# Altium schematic sheet Cart.SchDoc: Cart
size Tabloid; ApprovedBy: NA; CompanyName: Cospan Design LLC; DrawnBy: David McCoy; Engineer: David McCoy; DocumentNumber: 12; Revision: A; SheetNumber: 12; SheetTotal: 18; Client: OSH; Project: Guppy Buddy; ProjectPrettyName: Guppy Buddy
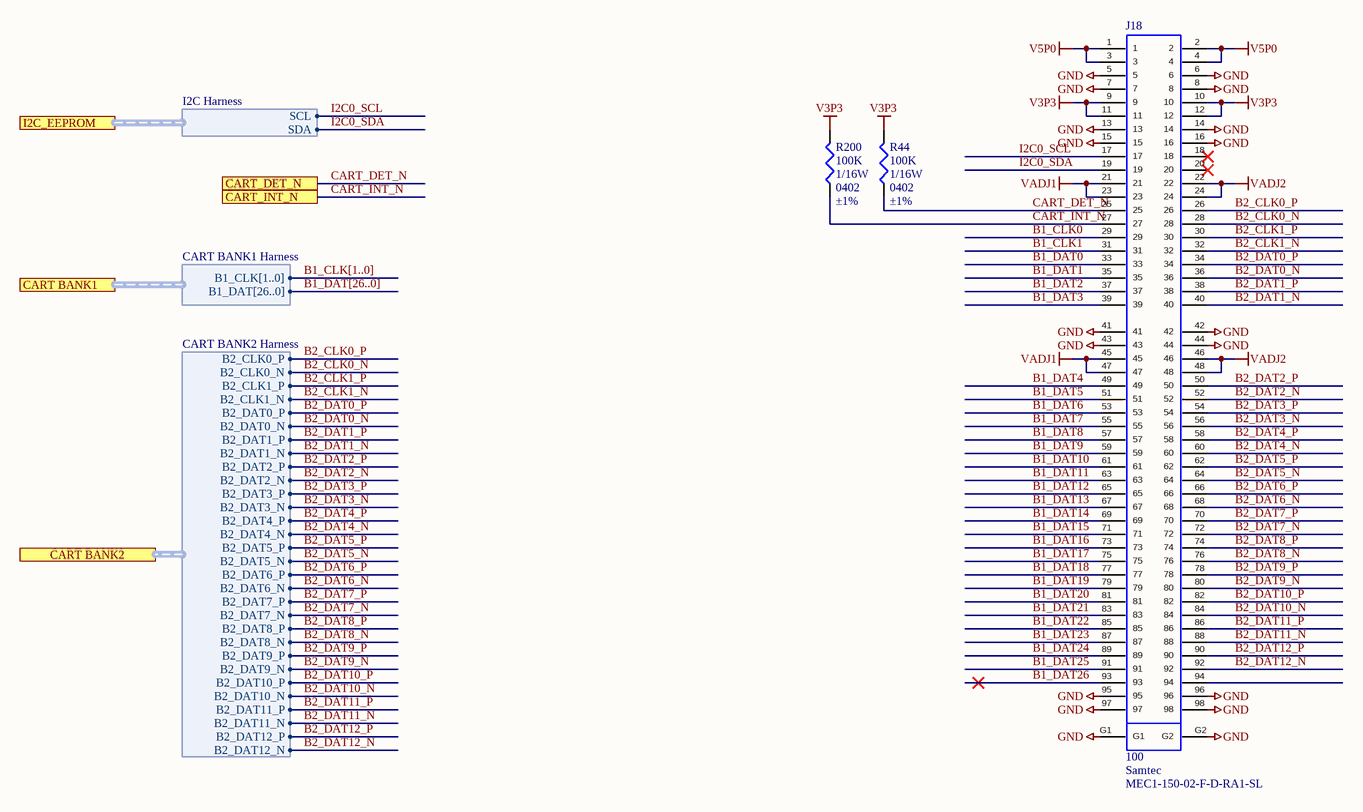
[diagram p0: Cart.SchDoc]

## Parts
J18  Number of Contacts: 100  Manufacturer 1: Samtec  Manufacturer Part Number 1: MEC1-150-02-F-D-RA1-SL  [MEC1-150-XX-XX-D-RAX-SL]  (hidden comment: J_MEC1-150-02-F-D-RA1-SL)
R44  Resistance In Ohms: 100K  Power (Watts): 1/16W  Case: 0402  Tolerance: ±1%  [R_0402]  (hidden comment: R_0402_100K)
R200  Resistance In Ohms: 100K  Power (Watts): 1/16W  Case: 0402  Tolerance: ±1%  [R_0402]  (hidden comment: R_0402_100K)

## Ports
CART BANK1 (harness CART BANK1 Harness), CART BANK2 (harness CART BANK2 Harness), CART_DET_N, CART_INT_N, I2C_EEPROM (harness I2C Harness)

## Harnesses
I2C Harness: SCL, SDA
CART BANK2 Harness: B2_CLK0_P, B2_CLK0_N, B2_CLK1_P, B2_CLK1_N, B2_DAT0_P, B2_DAT0_N, B2_DAT1_P, B2_DAT1_N, B2_DAT2_P, B2_DAT2_N, B2_DAT3_P, B2_DAT3_N, B2_DAT4_P, B2_DAT4_N, B2_DAT5_P, B2_DAT5_N, B2_DAT6_P, B2_DAT6_N, B2_DAT7_P, B2_DAT7_N, B2_DAT8_P, B2_DAT8_N, B2_DAT9_P, B2_DAT9_N, B2_DAT10_P, B2_DAT10_N, B2_DAT11_P, B2_DAT11_N, B2_DAT12_P, B2_DAT12_N
CART BANK1 Harness: B1_CLK[1..0], B1_DAT[26..0]

## Nets
GND: J18.5 J18.6 J18.7 J18.8 J18.13 J18.14 J18.15 J18.16 J18.41 J18.42 J18.43 J18.44 J18.95 J18.96 J18.97 J18.98 J18.G1 J18.G2
V3P3: J18.9 J18.10 J18.11 J18.12 R44.2 R200.2
V5P0: J18.1 J18.2 J18.3 J18.4
VADJ1: J18.21 J18.23 J18.45 J18.47
VADJ2: J18.22 J18.24 J18.46 J18.48
B1_CLK0: J18.29
B1_CLK1: J18.31
B1_DAT0: J18.33
B1_DAT1: J18.35
B1_DAT2: J18.37
B1_DAT3: J18.39
B1_DAT4: J18.49
B1_DAT5: J18.51
B1_DAT6: J18.53
B1_DAT7: J18.55
B1_DAT8: J18.57
B1_DAT9: J18.59
B1_DAT10: J18.61
B1_DAT11: J18.63
B1_DAT12: J18.65
B1_DAT13: J18.67
B1_DAT14: J18.69
B1_DAT15: J18.71
B1_DAT16: J18.73
B1_DAT17: J18.75
B1_DAT18: J18.77
B1_DAT19: J18.79
B1_DAT20: J18.81
B1_DAT21: J18.83
B1_DAT22: J18.85
B1_DAT23: J18.87
B1_DAT24: J18.89
B1_DAT25: J18.91
B1_DAT26: J18.93
B2_CLK0_N: J18.28 ; port CART BANK2.B2_CLK0_N
B2_CLK0_P: J18.26 ; port CART BANK2.B2_CLK0_P
B2_CLK1_N: J18.32 ; port CART BANK2.B2_CLK1_N
B2_CLK1_P: J18.30 ; port CART BANK2.B2_CLK1_P
B2_DAT0_N: J18.36 ; port CART BANK2.B2_DAT0_N
B2_DAT0_P: J18.34 ; port CART BANK2.B2_DAT0_P
B2_DAT1_N: J18.40 ; port CART BANK2.B2_DAT1_N
B2_DAT1_P: J18.38 ; port CART BANK2.B2_DAT1_P
B2_DAT2_N: J18.52 ; port CART BANK2.B2_DAT2_N
B2_DAT2_P: J18.50 ; port CART BANK2.B2_DAT2_P
B2_DAT3_N: J18.56 ; port CART BANK2.B2_DAT3_N
B2_DAT3_P: J18.54 ; port CART BANK2.B2_DAT3_P
B2_DAT4_N: J18.60 ; port CART BANK2.B2_DAT4_N
B2_DAT4_P: J18.58 ; port CART BANK2.B2_DAT4_P
B2_DAT5_N: J18.64 ; port CART BANK2.B2_DAT5_N
B2_DAT5_P: J18.62 ; port CART BANK2.B2_DAT5_P
B2_DAT6_N: J18.68 ; port CART BANK2.B2_DAT6_N
B2_DAT6_P: J18.66 ; port CART BANK2.B2_DAT6_P
B2_DAT7_N: J18.72 ; port CART BANK2.B2_DAT7_N
B2_DAT7_P: J18.70 ; port CART BANK2.B2_DAT7_P
B2_DAT8_N: J18.76 ; port CART BANK2.B2_DAT8_N
B2_DAT8_P: J18.74 ; port CART BANK2.B2_DAT8_P
B2_DAT9_N: J18.80 ; port CART BANK2.B2_DAT9_N
B2_DAT9_P: J18.78 ; port CART BANK2.B2_DAT9_P
B2_DAT10_N: J18.84 ; port CART BANK2.B2_DAT10_N
B2_DAT10_P: J18.82 ; port CART BANK2.B2_DAT10_P
B2_DAT11_N: J18.88 ; port CART BANK2.B2_DAT11_N
B2_DAT11_P: J18.86 ; port CART BANK2.B2_DAT11_P
B2_DAT12_N: J18.92 ; port CART BANK2.B2_DAT12_N
B2_DAT12_P: J18.90 ; port CART BANK2.B2_DAT12_P
CART_DET_N: J18.25 R44.1 ; port CART_DET_N
CART_INT_N: J18.27 R200.1 ; port CART_INT_N
I2C0_SCL: J18.17 ; port I2C_EEPROM.SCL
I2C0_SDA: J18.19 ; port I2C_EEPROM.SDA

Not connected (* = marked no-connect by the designer): J18 18* 20* 94

## Buses and harness runs
bus B1_CLK[1..0]
bus B1_DAT[26..0]

## Notes on the sheet
- Project:
- http://www.cospandesign.com
- Cospan Design
- Document:
- Engineer:
- Title:
- Client:
- Approved By:
- Revision:
- Date:
- Number:
- of

## Library data of the parts
J18 = J_MEC1-150-02-F-D-RA1-SL: 1MM MINI-EDGE CARD ASSEMBLY; Gender: Receptacle; Supplier 1: Digi-Key; Supplier Part Number 1: SAM12707-ND; Stock 1: 50; Pricing 1: 1=8.99, 10=8.602, 25=7.82, 50=7.429, 100=7.2335, 250=6.45152, 500=6.0605, 1000=5.3567 (USD); Mount: Surface Mount; Contact Plating: Gold; Contact Material: Bronze; Housing Colour: Black; Housing Material: Polymer; Min Operating Temperature: -55°C; Max Operating Temperature: 125°C; Packaging: Rail/Tube; Termination: Solder; Orientation: Right Angle; Pitch: 1mm; Radiation Hardening: No; REACH SVHC: No SVHC; Number of Rows: 2
R44 R200 = R_0402_100K: RES SMD 100K OHM 1% 1/16W 0402; Manufacturer: Yageo; Manufacturer Part Number: RC0402FR-07100KL; Temperature Coefficient: ±100ppm/°C; Supplier 1: Digi-Key; RoHS: RoHS Compliant; Category: Resistors; Stock 1: 4989982; Pricing 1: 1=0.1, 10=0.013, 25=0.0096, 100=0.0054, 250=0.00412, 500=0.00328, 1000=0.00242, 2500=0.0021, 5000=0.00173 (USD); Packaging: Cut Tape (CT); Resistance (Ohms): 100k; Composition: Thick Film; Features: Moisture Resistant; Operating Temperature: -55°C ~ 155°C; Package / Case: 0402 (1005 Metric); Supplier Device Package: 0402; Size / Dimension: 0.039" L x 0.020" W (1.00mm x 0.50mm); Height: 0.016" (0.40mm); Number of Terminations: 2; ComponentLink1URL: http://www.yageo.com/NewPortal/yageodocoutput?fileName=/pdf/R-Chip/PYu-RC_Group_51_RoHS_L_3.pdf; ComponentLink1Description: http://www.yageo.com/NewPortal/yageodocoutput?fileName=/pdf/R-Chip/PYu-RC_Group_51_RoHS_L_3.pdf; Supplier Part Number 1: 311-100KLRCT-ND